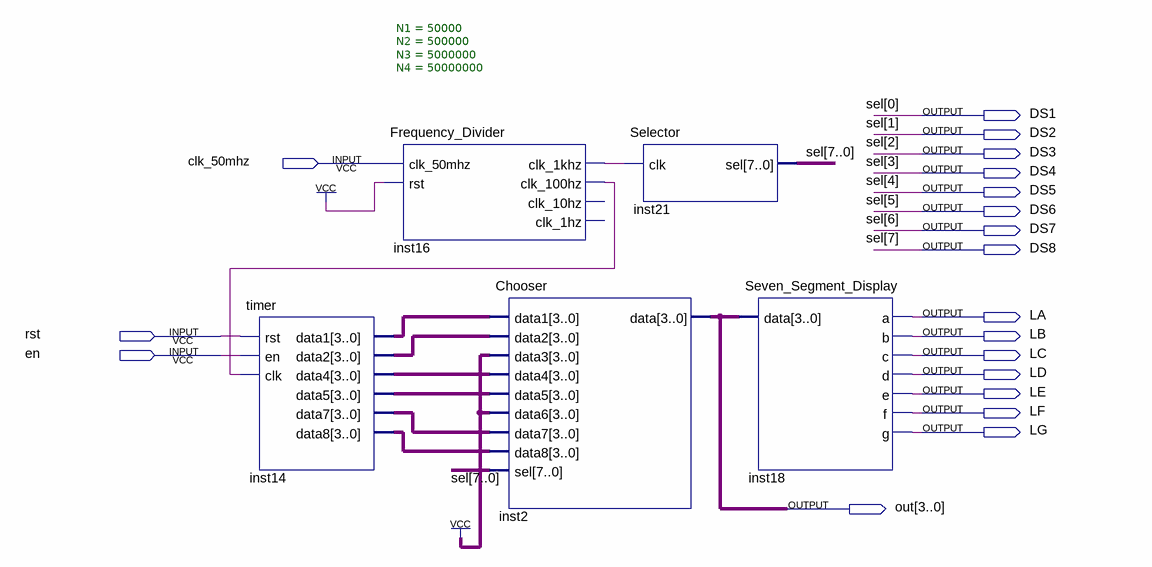
[diagram p0: schematic sheet]
// Quartus schematic Scanner.bdf as structural Verilog: 5 symbols, 19 pins
module Scanner (
  input  clk_50mhz,
  input  rst,
  input  en,
  output DS1,
  output DS2,
  output DS3,
  output DS4,
  output DS5,
  output DS6,
  output DS7,
  output DS8,
  output LA,
  output LB,
  output LC,
  output LD,
  output LE,
  output LF,
  output LG,
  output [3:0] out
);

  wire inst16_clk_1khz, inst16_clk_100hz;
  wire [3:0] inst14_data1, inst14_data2, inst14_data4, inst14_data5, inst14_data7, inst14_data8;

  timer inst14 (
    .rst(rst), .en(en), .clk(inst16_clk_100hz), .data1(inst14_data1), .data2(inst14_data2),
    .data4(inst14_data4), .data5(inst14_data5), .data7(inst14_data7), .data8(inst14_data8));
  Frequency_Divider #(.N1(50000), .N2(500000), .N3(5000000), .N4(50000000)) inst16 (
    .clk_50mhz(clk_50mhz), .rst(1'b1), .clk_1khz(inst16_clk_1khz), .clk_100hz(inst16_clk_100hz));  // open: clk_10hz, clk_1hz
  Chooser inst2 (
    .data1(inst14_data1), .data2(inst14_data2), .data3(4'b1111), .data4(inst14_data4), .data5(inst14_data5),
    .data6(4'b1111), .data7(inst14_data7), .data8(inst14_data8),
    .sel({DS8, DS7, DS6, DS5, DS4, DS3, DS2, DS1}), .data(out));
  Selector inst21 (.clk(inst16_clk_1khz), .sel({DS8, DS7, DS6, DS5, DS4, DS3, DS2, DS1}));
  Seven_Segment_Display inst18 (.data(out), .a(LA), .b(LB), .c(LC), .d(LD), .e(LE), .f(LF), .g(LG));

  // Other names for the same wires on the sheet: sel[7:0] = {DS8, DS7, DS6, DS5, DS4, DS3, DS2, DS1}
endmodule
